# Altium schematic sheet ESP32_Control_Board.SchDoc
size A3; SheetNumber: 1; SheetTotal: 1
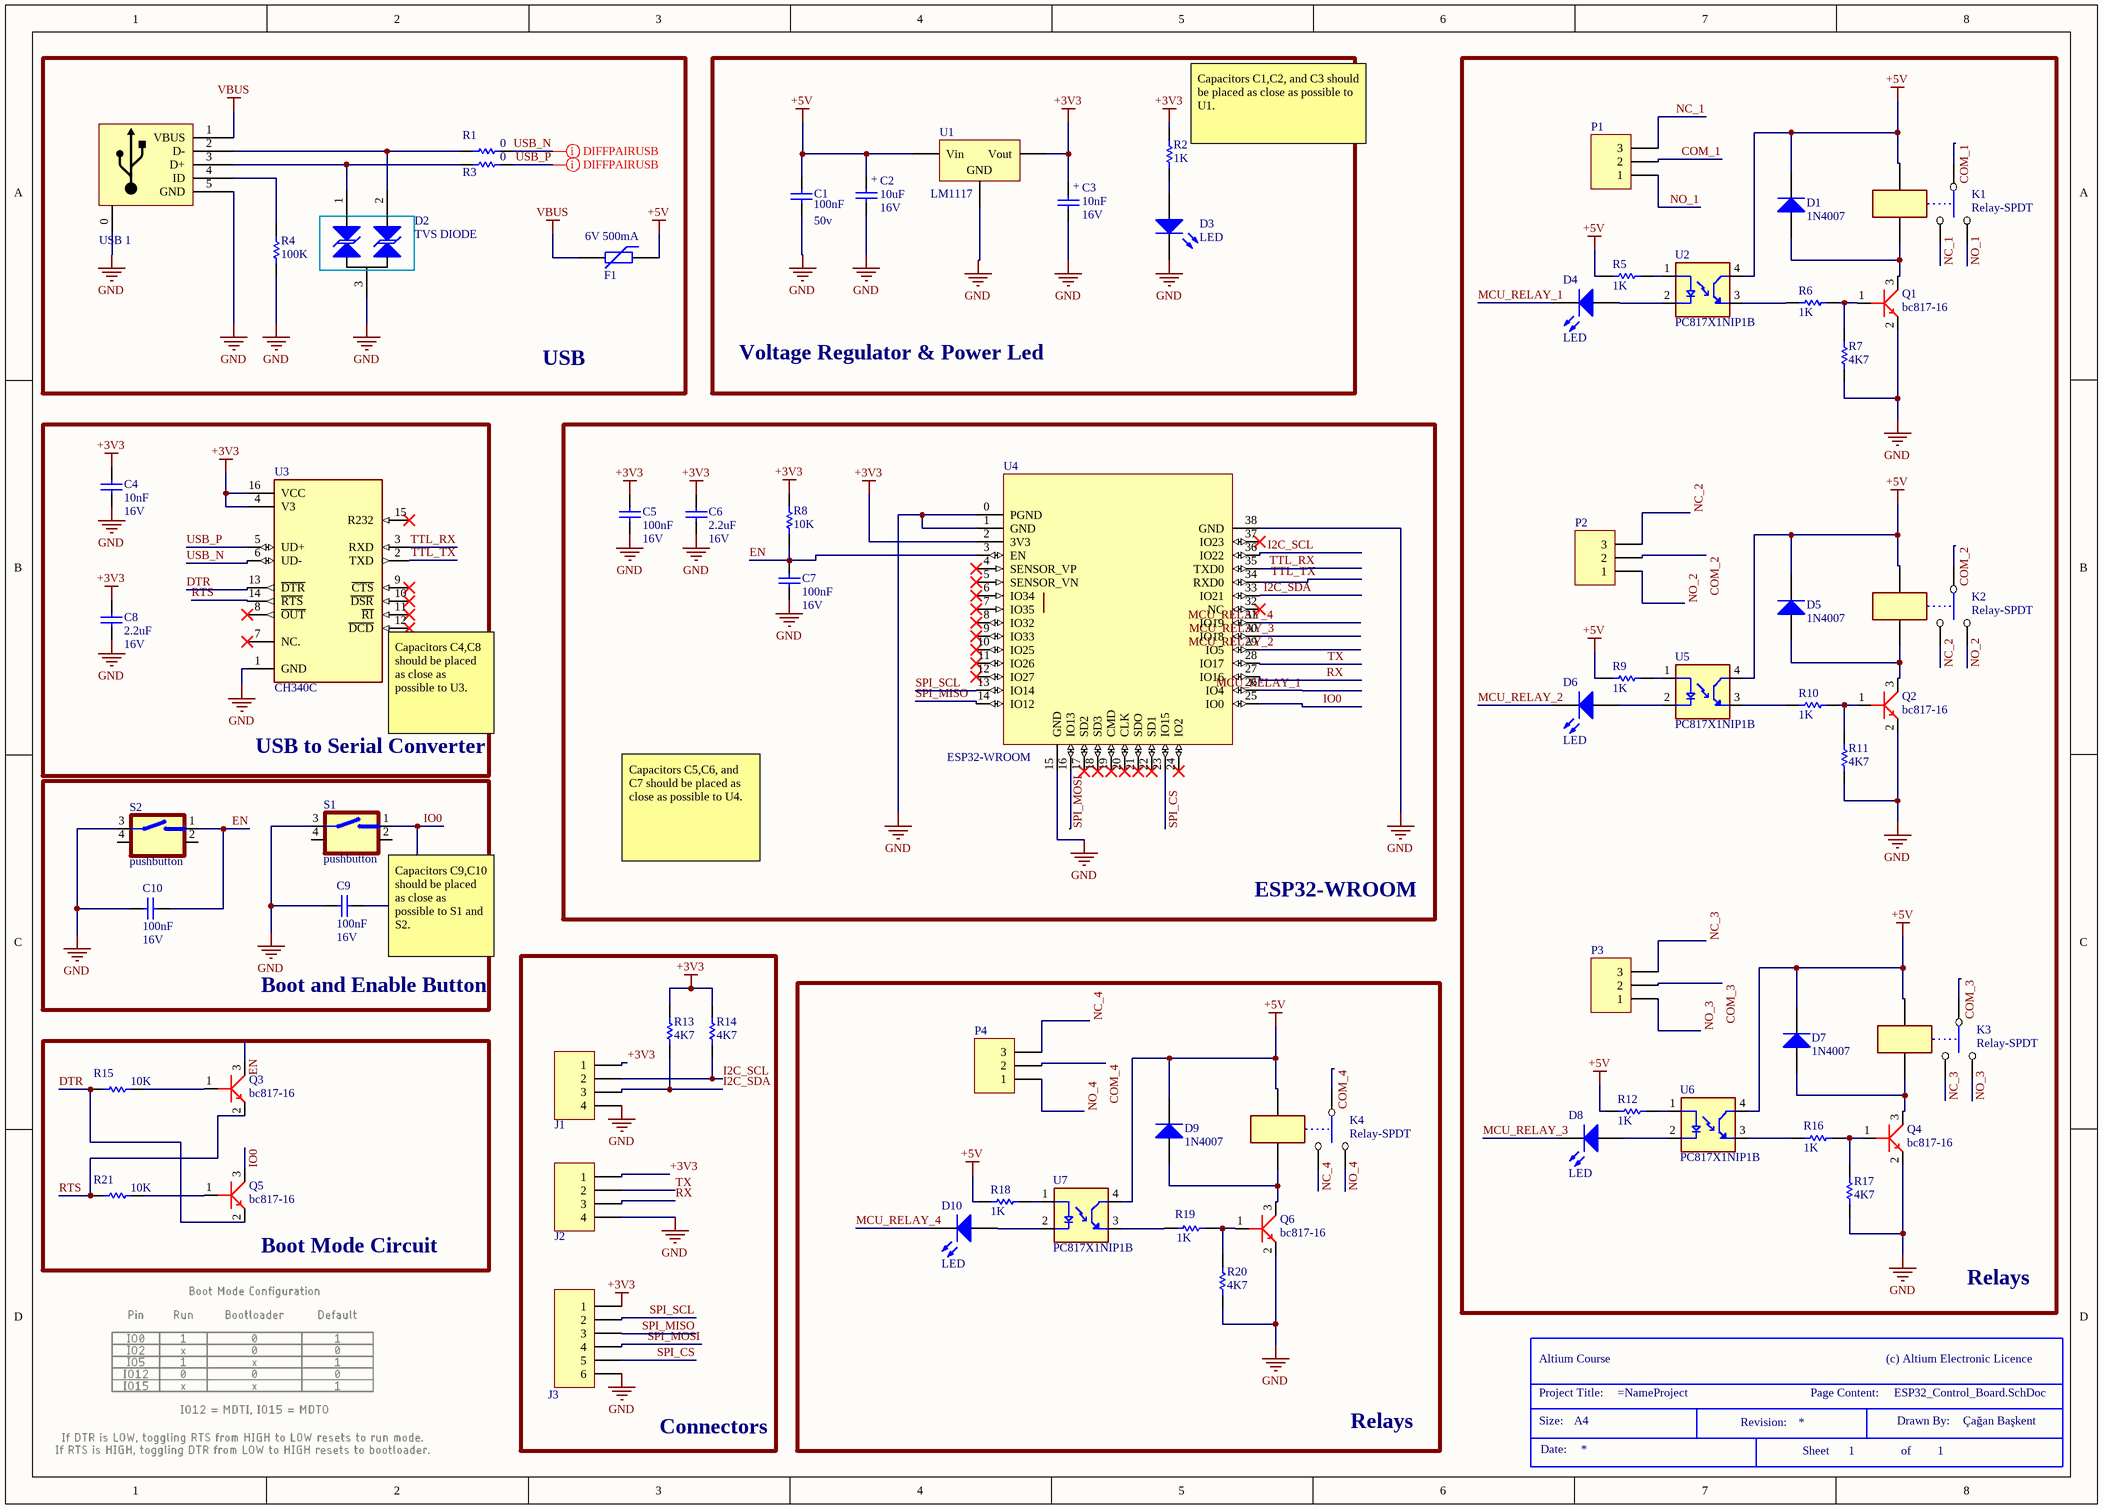
[diagram p0: ESP32_Control_Board.SchDoc]

## Parts
*??  Size: A4  Drawn By: Çağan Başkent  (hidden comment: Title Block)  (graphical)
C1  Volte: 50v  [MY_0805]  (hidden comment: 100nF)
C2  Volte: 16V  [MY_SMC_B]  (hidden comment: 10uF)
C3  Volte: 16V  [MY_SMC_A]  (hidden comment: 10nF)
C4  Volte: 16V  [MY_0805]  (hidden comment: 10nF)
C5  Volte: 16V  [MY_0805]  (hidden comment: 100nF)
C6  Volte: 16V  [MY_0805]  (hidden comment: 2.2uF)
C7  Volte: 16V  [MY_0805]  (hidden comment: 100nF)
C8  Volte: 16V  [MY_0805]  (hidden comment: 2.2uF)
C9  Volte: 16V  [MY_0805]  (hidden comment: 100nF)
C10  Volte: 16V  [MY_0805]  (hidden comment: 100nF)
D1  1N4007  [MY_1N4007_SMD]
D2  TVS DIODE  [SOT-23]
D3  LED  [MY_LED_1206]
D4  LED  [MY_LED_0805]
D5  1N4007  [MY_1N4007_SMD]
D6  LED  [MY_LED_0805]
D7  1N4007  [MY_1N4007_SMD]
D8  LED  [MY_LED_0805]
D9  1N4007  [MY_1N4007_SMD]
D10  LED  [MY_LED_0805]
F1  500mA  [PTC-0805]  (value not drawn)
J1  CONN-4  [XH-4]  (value not drawn)
J2  CONN-4  [XH-4]  (value not drawn)
J3  CONN-6  [XH-6]  (value not drawn)
K1  Relay-SPDT  [My_rel]
K2  Relay-SPDT  [My_rel]
K3  Relay-SPDT  [My_rel]
K4  Relay-SPDT  [My_rel]
P1  Header 3  [My_CN3]  (value not drawn)
P2  Header 3  [My_CN3]  (value not drawn)
P3  Header 3  [My_CN3]  (value not drawn)
P4  Header 3  [My_CN3]  (value not drawn)
Q1  bc817-16  [SOT23_3]
Q2  bc817-16  [SOT23_3]
Q3  bc817-16  [SOT23_3]
Q4  bc817-16  [SOT23_3]
Q5  bc817-16  [SOT23_3]
Q6  bc817-16  [SOT23_3]
R1  0  [MY_0805]
R2  1K  [MY_0805]
R3  0  [MY_0805]
R4  100K  [MY_0805]
R5  1K  [MY_0805]
R6  1K  [MY_0805]
R7  4K7  [MY_0805]
R8  10K  [MY_0805]
R9  1K  [MY_0805]
R10  1K  [MY_0805]
R11  4K7  [MY_0805]
R12  1K  [MY_0805]
R13  4K7  [MY_0805]
R14  4K7  [MY_0805]
R15  10K  [MY_0805]
R16  1K  [MY_0805]
R17  4K7  [MY_0805]
R18  1K  [MY_0805]
R19  1K  [MY_0805]
R20  4K7  [MY_0805]
R21  10K  [MY_0805]
S1  pushbutton  [button]
S2  pushbutton  [button]
U1  LM1117  [MY_SOT223]
U2  PC817X1NIP1B  [SOIC254P960X420-4N]
U3  CH340C  [SOIC-16N]
U4  ESP32-WROOM  [ESP32-WROOM32]
U5  PC817X1NIP1B  [SOIC254P960X420-4N]
U6  PC817X1NIP1B  [SOIC254P960X420-4N]
U7  PC817X1NIP1B  [SOIC254P960X420-4N]
USB_1  USB MINI  [USB-MINI-SMD]  (value not drawn)

## Blocks framed on the sheet
USB: D2 F1 R1 R3 R4 USB_1
Voltage Regulator & Power Led: C1-C3 D3 R2 U1
Relays: D1 D4-D8 K1-K3 P1-P3 Q1 Q2 Q4 R5-R7 R9-R12 R16 R17 U2 U5 U6
USB to Serial Converter: C4 C8 U3
ESP32-WROOM: C5-C7 R8 U4
Boot and Enable Button: C9 C10 S1 S2
Connectors: J1-J3 R13 R14
Relays: D9 D10 K4 P4 Q6 R18-R20 U7
Boot Mode Circuit: Q3 Q5 R15 R21

## Nets
+3V3: C3.+ C4.2 C5.2 C6.2 C8.2 J1.1 J2.1 J3.1 R2.1 R8.1 R13.2 R14.2 U1.2(Vout) U3.4(V3) U3.16(VCC) U4.2(3V3)
+5V: C1.2 C2.+ D1.K D5.K D7.K D9.K F1.1 K1.4 K2.4 K3.4 K4.4 R5.1 R9.1 R12.1 R18.1 U1.3(Vin) U2.4(CT) U5.4(CT) U6.4(CT) U7.4(CT)
GND: C1.1 C2.- C3.- C4.1 C5.1 C6.1 C7.1 C8.1 C9.1 C10.1 D2.3(A) D3.K J1.4 J2.4 J3.6 Q1.2(E) Q2.2(E) Q4.2(E) Q6.2(E) R4.2 R7.1 R11.1 R17.1 R20.1 S1.3 S2.3 U1.1(GND) U3.1(GND) U4.0(PGND) U4.1(GND) U4.15(GND) U4.38(GND) USB_1.0(BODY) USB_1.5(GND)
VBUS: F1.2 USB_1.1(VBUS)
COM_1: K1.1 P1.2
COM_2: K2.1 P2.2
COM_3: K3.1 P3.2
COM_4: K4.1 P4.2
DTR: Q5.2(E) R15.1 U3.13(~{DTR})
EN: C7.2 C10.2 Q3.3(C) R8.2 S2.1 U4.3(EN)
I2C_SCL: J1.2 R14.1 U4.36(IO22)
I2C_SDA: J1.3 R13.1 U4.33(IO21)
IO0: C9.2 Q5.3(C) S1.1 U4.25(IO0)
MCU_RELAY_1: D4.K U4.26(IO4)
MCU_RELAY_2: D6.K U4.29(IO5)
MCU_RELAY_3: D8.K U4.30(IO18)
MCU_RELAY_4: D10.K U4.31(IO19)
NC_1: K1.3 P1.3
NC_2: K2.3 P2.3
NC_3: K3.3 P3.3
NC_4: K4.3 P4.3
NO_1: K1.2 P1.1
NO_2: K2.2 P2.1
NO_3: K3.2 P3.1
NO_4: K4.2 P4.1
RTS: Q3.2(E) R21.1 U3.14(~{RTS})
RX: J2.3 U4.27(IO16)
SPI_CS: J3.5 U4.23(IO15)
SPI_MISO: J3.3 U4.14(IO12)
SPI_MOSI: J3.4 U4.16(IO13)
SPI_SCL: J3.2 U4.13(IO14)
TTL_RX: U3.3(RXD) U4.35(TXD0)
TTL_TX: U3.2(TXD) U4.34(RXD0)
TX: J2.2 U4.28(IO17)
USB_N: R1.2 U3.6(UD-)
USB_P: R3.2 U3.5(UD+)
NetD1_A: D1.A K1.5 Q1.3(C)
NetD2_1: D2.1(K) R3.1 USB_1.3(D+)
NetD2_2: D2.2(K) R1.1 USB_1.2(D-)
NetD3_A: D3.A R2.2
NetD4_A: D4.A U2.2(C)
NetD5_A: D5.A K2.5 Q2.3(C)
NetD6_A: D6.A U5.2(C)
NetD7_A: D7.A K3.5 Q4.3(C)
NetD8_A: D8.A U6.2(C)
NetD9_A: D9.A K4.5 Q6.3(C)
NetD10_A: D10.A U7.2(C)
NetQ1_1: Q1.1(B) R6.2 R7.2
NetQ2_1: Q2.1(B) R10.2 R11.2
NetQ3_1: Q3.1(B) R15.2
NetQ4_1: Q4.1(B) R16.2 R17.2
NetQ5_1: Q5.1(B) R21.2
NetQ6_1: Q6.1(B) R19.2 R20.2
NetR4_1: R4.1 USB_1.4(ID)
NetR5_2: R5.2 U2.1(A)
NetR6_1: R6.1 U2.3(ET)
NetR9_2: R9.2 U5.1(A)
NetR10_1: R10.1 U5.3(ET)
NetR12_2: R12.2 U6.1(A)
NetR16_1: R16.1 U6.3(ET)
NetR18_2: R18.2 U7.1(A)
NetR19_1: R19.1 U7.3(ET)

Not connected (* = marked no-connect by the designer): S1 2 4(1); S2 2 4(1); U3 7(NC.)* 8(~{OUT})* 9(~{CTS})* 10(~{DSR})* 11(~{RI})* 12(~{DCD})* 15(R232)*; U4 4(SENSOR_VP)* 5(SENSOR_VN)* 6(IO34)* 7(IO35)* 8(IO32)* 9(IO33)* 10(IO25)* 11(IO26)* 12(IO27)* 17(SD2)* 18(SD3)* 19(CMD)* 20(CLK)* 21(SDO)* 22(SD1)* 24(IO2)* 32(NC)* 37(IO23)*

## Layout directives
differential pair; differential pair class DiffPairUSB: USB_N, USB_P

## Notes on the sheet
- (near R2) Capacitors C1,C2, and C3 should be placed as close as possible to U1.
- (near F1) 6V 500mA
- (near U3) Capacitors C4,C8 should be placed as close as possible to U3.
- Capacitors C5,C6, and C7 should be placed as close as possible to U4.
- (near S1) Capacitors C9,C10 should be placed as close as possible to S1 and S2.
- (in symbol Title Block) Altium Course; (c) Altium Electronic Licence; Project Title:; Page Content:; Size:; Revision:; Drawn By:; Date:; Sheet; of

## Library data of the parts
C1 C4-C10 = Cap ceramic: None polar capacitor; ASiD Part Number: C-AS
  C1 C5 C7 C9 C10: Value: 100nF
  C4: Value: 10nF
  C6 C8: Value: 2.2uF
C2 C3 = Cap Pol: Polar capacitor; ASiD Part Number: C-AS
  C2: Value: 10uF
  C3: Value: 10nF
D1 D5 D7 D9 = 1N4007: 1 Amp Diode; ASiD Part Number: 1n4007-AS
D2 = SM712
D3 D4 D6 D8 D10 = LED: Typical INFRARED GaAs LED; ASiD Part Number: LED-AS
F1 = PTC: Published: 24-Mar-1999; PackageVersion: Mar-2003; PackageReference: 6-0805
K1-K4 = Relay-SPDT: Standard single contact relay; ASiD Part Number: Relay-SPDT-AS
P1-P4 = Header 3: Header, 3-Pin; ASiD Part Number: Header 3-AS
R1-R21 = Res: Standard resistor; ASiD Part Number: Res-AS
  R1 R3: Value: 0
  R2 R5 R6 R9 R10 R12 R16 R18 R19: Value: 1K
  R4: Value: 100K
  R7 R11 R13 R14 R17 R20: Value: 4K7
  R8 R15 R21: Value: 10K
U1 = LM1117: Low Drop Voltage Reg; ASiD Part Number: LM1117-AS
U2 U5-U7 = PC817X1NIP1B: Optoisolator Transistor Output 1 Channel 4-SMD; MF: Sharp Microelectronics; SnapEDA_Link: https://www.snapeda.com/parts/PC817X1NIP1B/Sharp+Microelectronics/view-part/?ref=snap; Package: None; Value: *; MP: PC817X1NIP1B; Check_prices: https://www.snapeda.com/parts/PC817X1NIP1B/Sharp+Microelectronics/view-part/?ref=eda
U3 = CH340C: Replacement for Brother P-Touch; MF: Olimex; SnapEDA_Link: https://www.snapeda.com/parts/CH340C/Olimex/view-part/?ref=snap; Package: None; Value: *; MP: CH340C; Check_prices: https://www.snapeda.com/parts/CH340C/Olimex/view-part/?ref=eda
U4 = ESP32-WROOM32